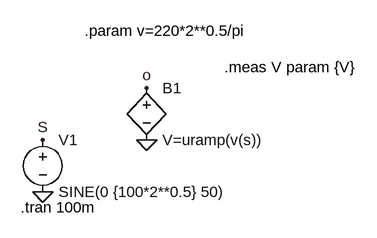
[diagram p0: schematic Draft1.asc]
Draft1.asc, the LTspice schematic file:
Version 4
SHEET 1 880 680
FLAG 96 192 0
FLAG 96 112 S
FLAG 256 112 0
FLAG 256 32 o
SYMBOL voltage 96 96 R0
WINDOW 123 0 0 Left 0
WINDOW 39 0 0 Left 0
SYMATTR InstName V1
SYMATTR Value SINE(0 {100*2**0.5} 50)
SYMBOL bv 256 16 R0
SYMATTR InstName B1
SYMATTR Value V=uramp(v(s))
TEXT 62 216 Left 2 !.tran 100m
TEXT 160 -56 Left 2 !.param v=220*2**0.5/pi
TEXT 376 0 Left 2 !.meas V param {V}

The netlist it stands for:
* Draft1.asc
V1 S 0 SINE(0 {100*2**0.5} 50)
B1 o 0 V=uramp(v(s))
.tran 100m
.param v=220*2**0.5/pi
.meas V param {V}
.backanno
.end